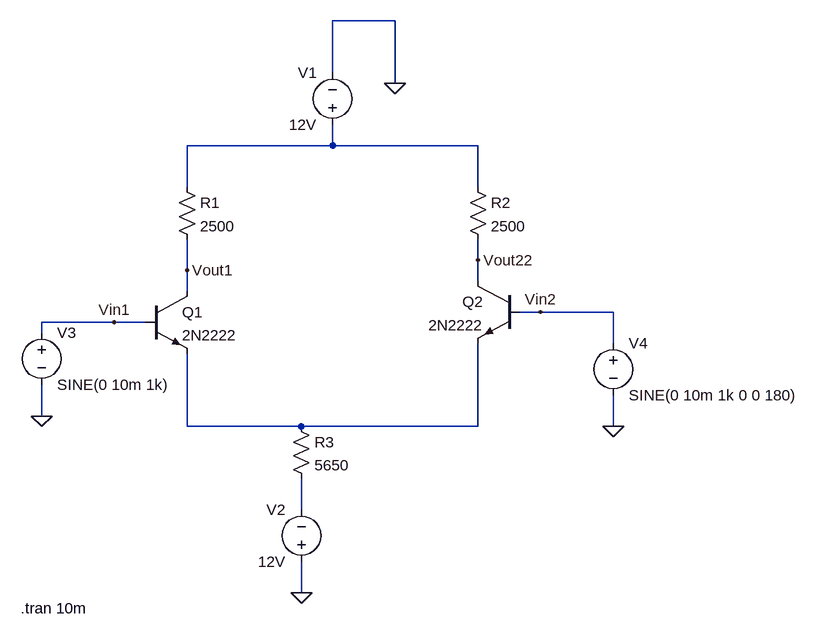
[diagram p0: schematic prelab2.asc]
prelab2.asc, the LTspice schematic file:
Version 4.1
SHEET 1 900 904
WIRE 256 -16 160 -16
WIRE 160 64 160 -16
WIRE 256 80 256 -16
WIRE 160 176 160 144
WIRE 160 176 -64 176
WIRE 384 176 160 176
WIRE -64 240 -64 176
WIRE 384 240 384 176
WIRE 384 352 384 320
WIRE -64 368 -64 320
WIRE 384 384 384 352
WIRE -64 400 -64 368
WIRE 480 432 448 432
WIRE 592 432 480 432
WIRE -176 448 -288 448
WIRE -128 448 -176 448
WIRE -288 464 -288 448
WIRE 592 480 592 432
WIRE -288 592 -288 544
WIRE -64 608 -64 496
WIRE 112 608 -64 608
WIRE 384 608 384 480
WIRE 384 608 112 608
WIRE 592 608 592 560
WIRE 112 736 112 688
WIRE 112 864 112 816
FLAG 112 864 0
FLAG 256 80 0
FLAG -288 592 0
FLAG 592 608 0
FLAG -176 448 Vin1
FLAG 480 432 Vin2
FLAG -64 368 Vout1
FLAG 384 352 Vout22
SYMBOL voltage 160 160 R180
WINDOW 0 24 96 Left 2
WINDOW 3 24 16 Left 2
WINDOW 123 0 0 Left 0
WINDOW 39 0 0 Left 0
SYMATTR InstName V1
SYMATTR Value 12V
SYMBOL res -80 224 R0
SYMATTR InstName R1
SYMATTR Value 2500
SYMBOL res 368 224 R0
SYMATTR InstName R2
SYMATTR Value 2500
SYMBOL res 96 592 R0
SYMATTR InstName R3
SYMATTR Value 5650
SYMBOL npn -128 400 R0
SYMATTR InstName Q1
SYMATTR Value 2N2222
SYMBOL npn 448 384 M0
SYMATTR InstName Q2
SYMATTR Value 2N2222
SYMBOL voltage 112 832 R180
WINDOW 0 24 96 Left 2
WINDOW 3 24 16 Left 2
WINDOW 123 0 0 Left 0
WINDOW 39 0 0 Left 0
SYMATTR InstName V2
SYMATTR Value 12V
SYMBOL voltage -288 448 R0
SYMATTR InstName V3
SYMATTR Value SINE(0 10m 1k)
SYMBOL voltage 592 464 R0
SYMATTR InstName V4
SYMATTR Value SINE(0 10m 1k 0 0 180)
TEXT -320 888 Left 2 !.tran 10m

The netlist it stands for:
* prelab2.asc
V1 N001 0 12V
R1 N001 Vout1 2500
R2 N001 Vout22 2500
R3 N002 N003 5650
Q1 Vout1 Vin1 N002 0 2N2222
Q2 Vout22 Vin2 N002 0 2N2222
V2 0 N003 12V
V3 Vin1 0 SINE(0 10m 1k)
V4 Vin2 0 SINE(0 10m 1k 0 0 180)
.model NPN NPN
.model PNP PNP
.lib standard.bjt
.tran 10m
.backanno
.end